# Altium project Template_top.PrjPcb
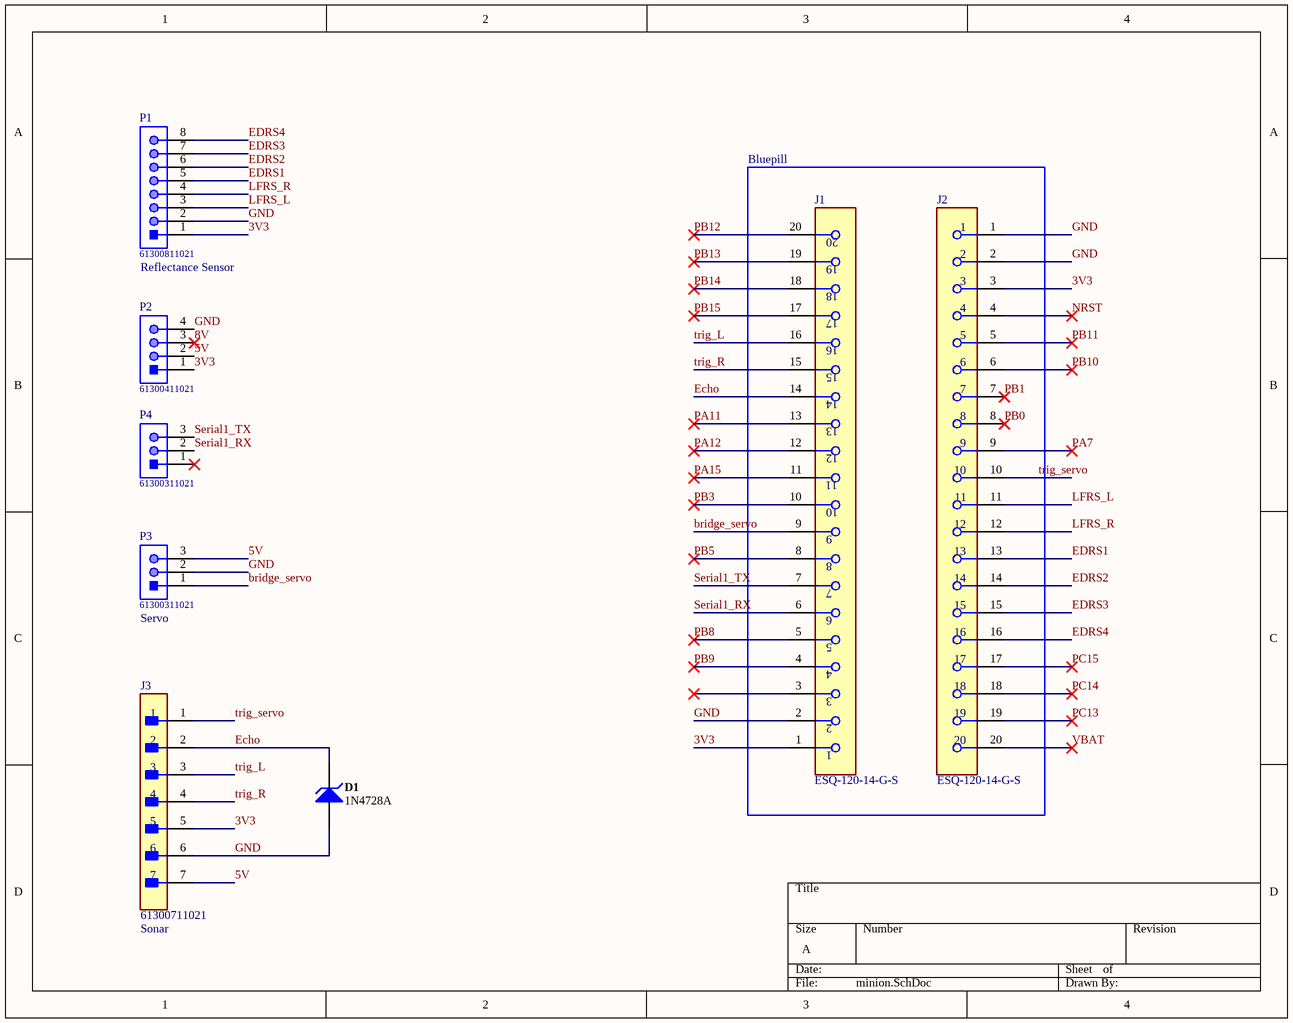
[diagram p0: minion.SchDoc]
1 sheet, 8 parts. Net scope: global (net labels, ports and power ports of the same name join across sheets).
Board file: PCB2.PcbDoc

## Sheet minion.SchDoc
size A

### Parts
D1  1N4728A  [FAIR-DO-41-2_V]
J1  ESQ-120-14-G-S  [FP-ESQ-120-14-G-S-MFG]
J2  ESQ-120-14-G-S  [FP-ESQ-120-14-G-S-MFG]
J3  61300711021  [FP-61300711021-MFG]
P1  61300811021  [61300811021]
P2  61300411021  [61300411021]
P3  61300311021  [61300311021]
P4  61300311021  [61300311021]

### Blocks framed on the sheet
Bluepill: J1 J2

### Nets
3V3: J1.1 J2.3 J3.5 P1.1 P2.1
5V: J3.7 P2.2 P3.3
8V: P2.3
bridge_servo: J1.9 P3.1
Echo: D1.2(K) J1.14 J3.2
EDRS1: J2.13 P1.5
EDRS2: J2.14 P1.6
EDRS3: J2.15 P1.7
EDRS4: J2.16 P1.8
GND: D1.1(A) J1.2 J2.1 J2.2 J3.6 P1.2 P2.4 P3.2
LFRS_L: J2.11 P1.3
LFRS_R: J2.12 P1.4
NRST: J2.4
PA7: J2.9
PA11: J1.13
PA12: J1.12
PA15: J1.11
PB0: J2.8
PB1: J2.7
PB3: J1.10
PB5: J1.8
PB8: J1.5
PB9: J1.4
PB10: J2.6
PB11: J2.5
PB12: J1.20
PB13: J1.19
PB14: J1.18
PB15: J1.17
PC13: J2.19
PC14: J2.18
PC15: J2.17
Serial1_RX: J1.6 P4.2
Serial1_TX: J1.7 P4.3
trig_L: J1.16 J3.3
trig_R: J1.15 J3.4
trig_servo: J2.10 J3.1
VBAT: J2.20

Not connected (* = marked no-connect by the designer): J1 3*; P4 1*

### Notes on the sheet
- (near P1) Reflectance Sensor
- (near P3) Servo
- (near J3) Sonar

### Library data of the parts
D1 = CMP-0892-00028-1: Zener Diode, 3.3V, 1W, 5%, -65 to 200 degC, 2-Pin DO-41, Body 2.72 x 5.2 mm, RoHS; Manufacturer: Fairchild Semiconductor; PD (W): 1; VZ (Max.) (V): 3.465; IR (uA): 100; ZZ (Max) (ohm): 10; Test Current IZ (mA): 76; VZ (Min.) (V): 3.135; DatasheetVersion: Rev. H3; Tolerance: 5%; ComponentLink3URL: http://www.fairchildsemi.com/dwg/DO/DO41A.pdf; ComponentLink2Description: Datasheet; PackageDescription: 2-Pin Axial leaded, Body 2.72 x 5.2 mm, Lead Spread 25.4 mm; PartNumber: 1N4728A; Operating and Storage Temperature Range: -65 to 200 degC; Mounting Technology: Through Hole; ComponentLink3Description: Package Specification; PackageReference: DO-41-2; ComponentLink1URL: http://www.fairchildsemi.com/; RoHS: TRUE; ComponentLink1Description: Manufacturer URL; ComponentLink2URL: http://www.fairchildsemi.com/ds/1N/1N4744A.pdf; PackageVersion: Rev. 2
J1 J2 = CMP-02766-000124-1: CONN SOCKET 20POS 0.1 GOLD PCB; Connector Type: Receptacle; Number of Contacts: 20; Contact Resistance: 10mR; Max Voltage Rating (AC): 550V; Max Current Rating: 6.9A; Pitch: 2.54mm; Termination: Solder; Number of Rows: 1; Contact Material: Bronze; Min Operating Temperature: -55°C; Gender: Receptacle; Length: 51.31mm; Orientation: Straight; Max Operating Temperature: 125°C; Radiation Hardening: No; Housing Color: Black; Contact Plating: Gold; REACH SVHC: No SVHC; Packaging: Rail/Tube; Depth: 2.41mm; Housing Material: Polyester; Number of Positions: 20; Mount: Through Hole; Color: Black
J3 = CMP-1502-01073-2: CONN HEADER R/A 7POS 2.54MM; Connector Type: Male Pin; Number of Positions: 7; Pitch: 0.1inch; Gender: Male; Termination: Solder; Contact Plating: Gold; Contact Material: Copper; Number of Rows: 1; Color: Black; Contact Mating Length: 0.236inch; Contact Type: Male Pin; Mount: Through Hole; Packaging: Bulk; Number of Contacts: 7; Series: WR-PHD
P1 = CMP-1502-01075-1: THT Angled Pin Header WR-PHD, Pitch 2.54 mm, Single Row, 8 pins; Manufacturer: Wurth Elektronik; Pin Number: 8; Rated Current: 3A; Working Voltage: 250VAC; Withstanding Voltage: 500VAC; Gender: Male; Contact Resistance: 20mOhm; Pitch: 2.54mm; Part Number: 61300811021; Publisher: WurthElektronik; Manufacturer URL: http://www.we-online.de; Row Number: Single; Datasheet URL: https://katalog.we-online.de/em/datasheet/6130xx11021.pdf; Orientation: Angled; Operating Temperature: -40to105degC; Mounting Technology: THT; Package Reference: 61300811021; Packaging: Bag
P2 = CMP-1502-01063-1: THT Angled Pin Header WR-PHD, Pitch 2.54 mm, Single Row, 4 pins; Manufacturer: Wurth Elektronik; Gender: Male; Pin Number: 4; Withstanding Voltage: 500VAC; Working Voltage: 250VAC; Contact Resistance: 20mOhm; Pitch: 2.54mm; Rated Current: 3A; Manufacturer URL: http://www.we-online.de; Mounting Technology: THT; Publisher: WurthElektronik; Operating Temperature: -40to105degC; Packaging: Bag; Row Number: Single; Package Reference: 61300411021; Part Number: 61300411021; Orientation: Angled; Datasheet URL: https://katalog.we-online.de/em/datasheet/6130xx11021.pdf
P3 P4 = CMP-1502-01061-1: THT Angled Pin Header WR-PHD, Pitch 2.54 mm, Single Row, 3 pins; Manufacturer: Wurth Elektronik; Pitch: 2.54mm; Contact Resistance: 20mOhm; Gender: Male; Pin Number: 3; Rated Current: 3A; Working Voltage: 250VAC; Withstanding Voltage: 500VAC; Package Reference: 61300311021; Manufacturer URL: http://www.we-online.de; Datasheet URL: https://katalog.we-online.de/em/datasheet/6130xx11021.pdf; Row Number: Single; Operating Temperature: -40to105degC; Publisher: WurthElektronik; Orientation: Angled; Mounting Technology: THT; Part Number: 61300311021; Packaging: Bag